# EasyEDA schematic SCH_slime-vr_2022-05-18.json

## Sheets
1 SlimeVR_SCH: TITLE: SlimeVR_SCH; REV: 1.0; Date: 2022-03-29; Sheet: 1/1; Drawn By: 复合体; Company: D9Lab
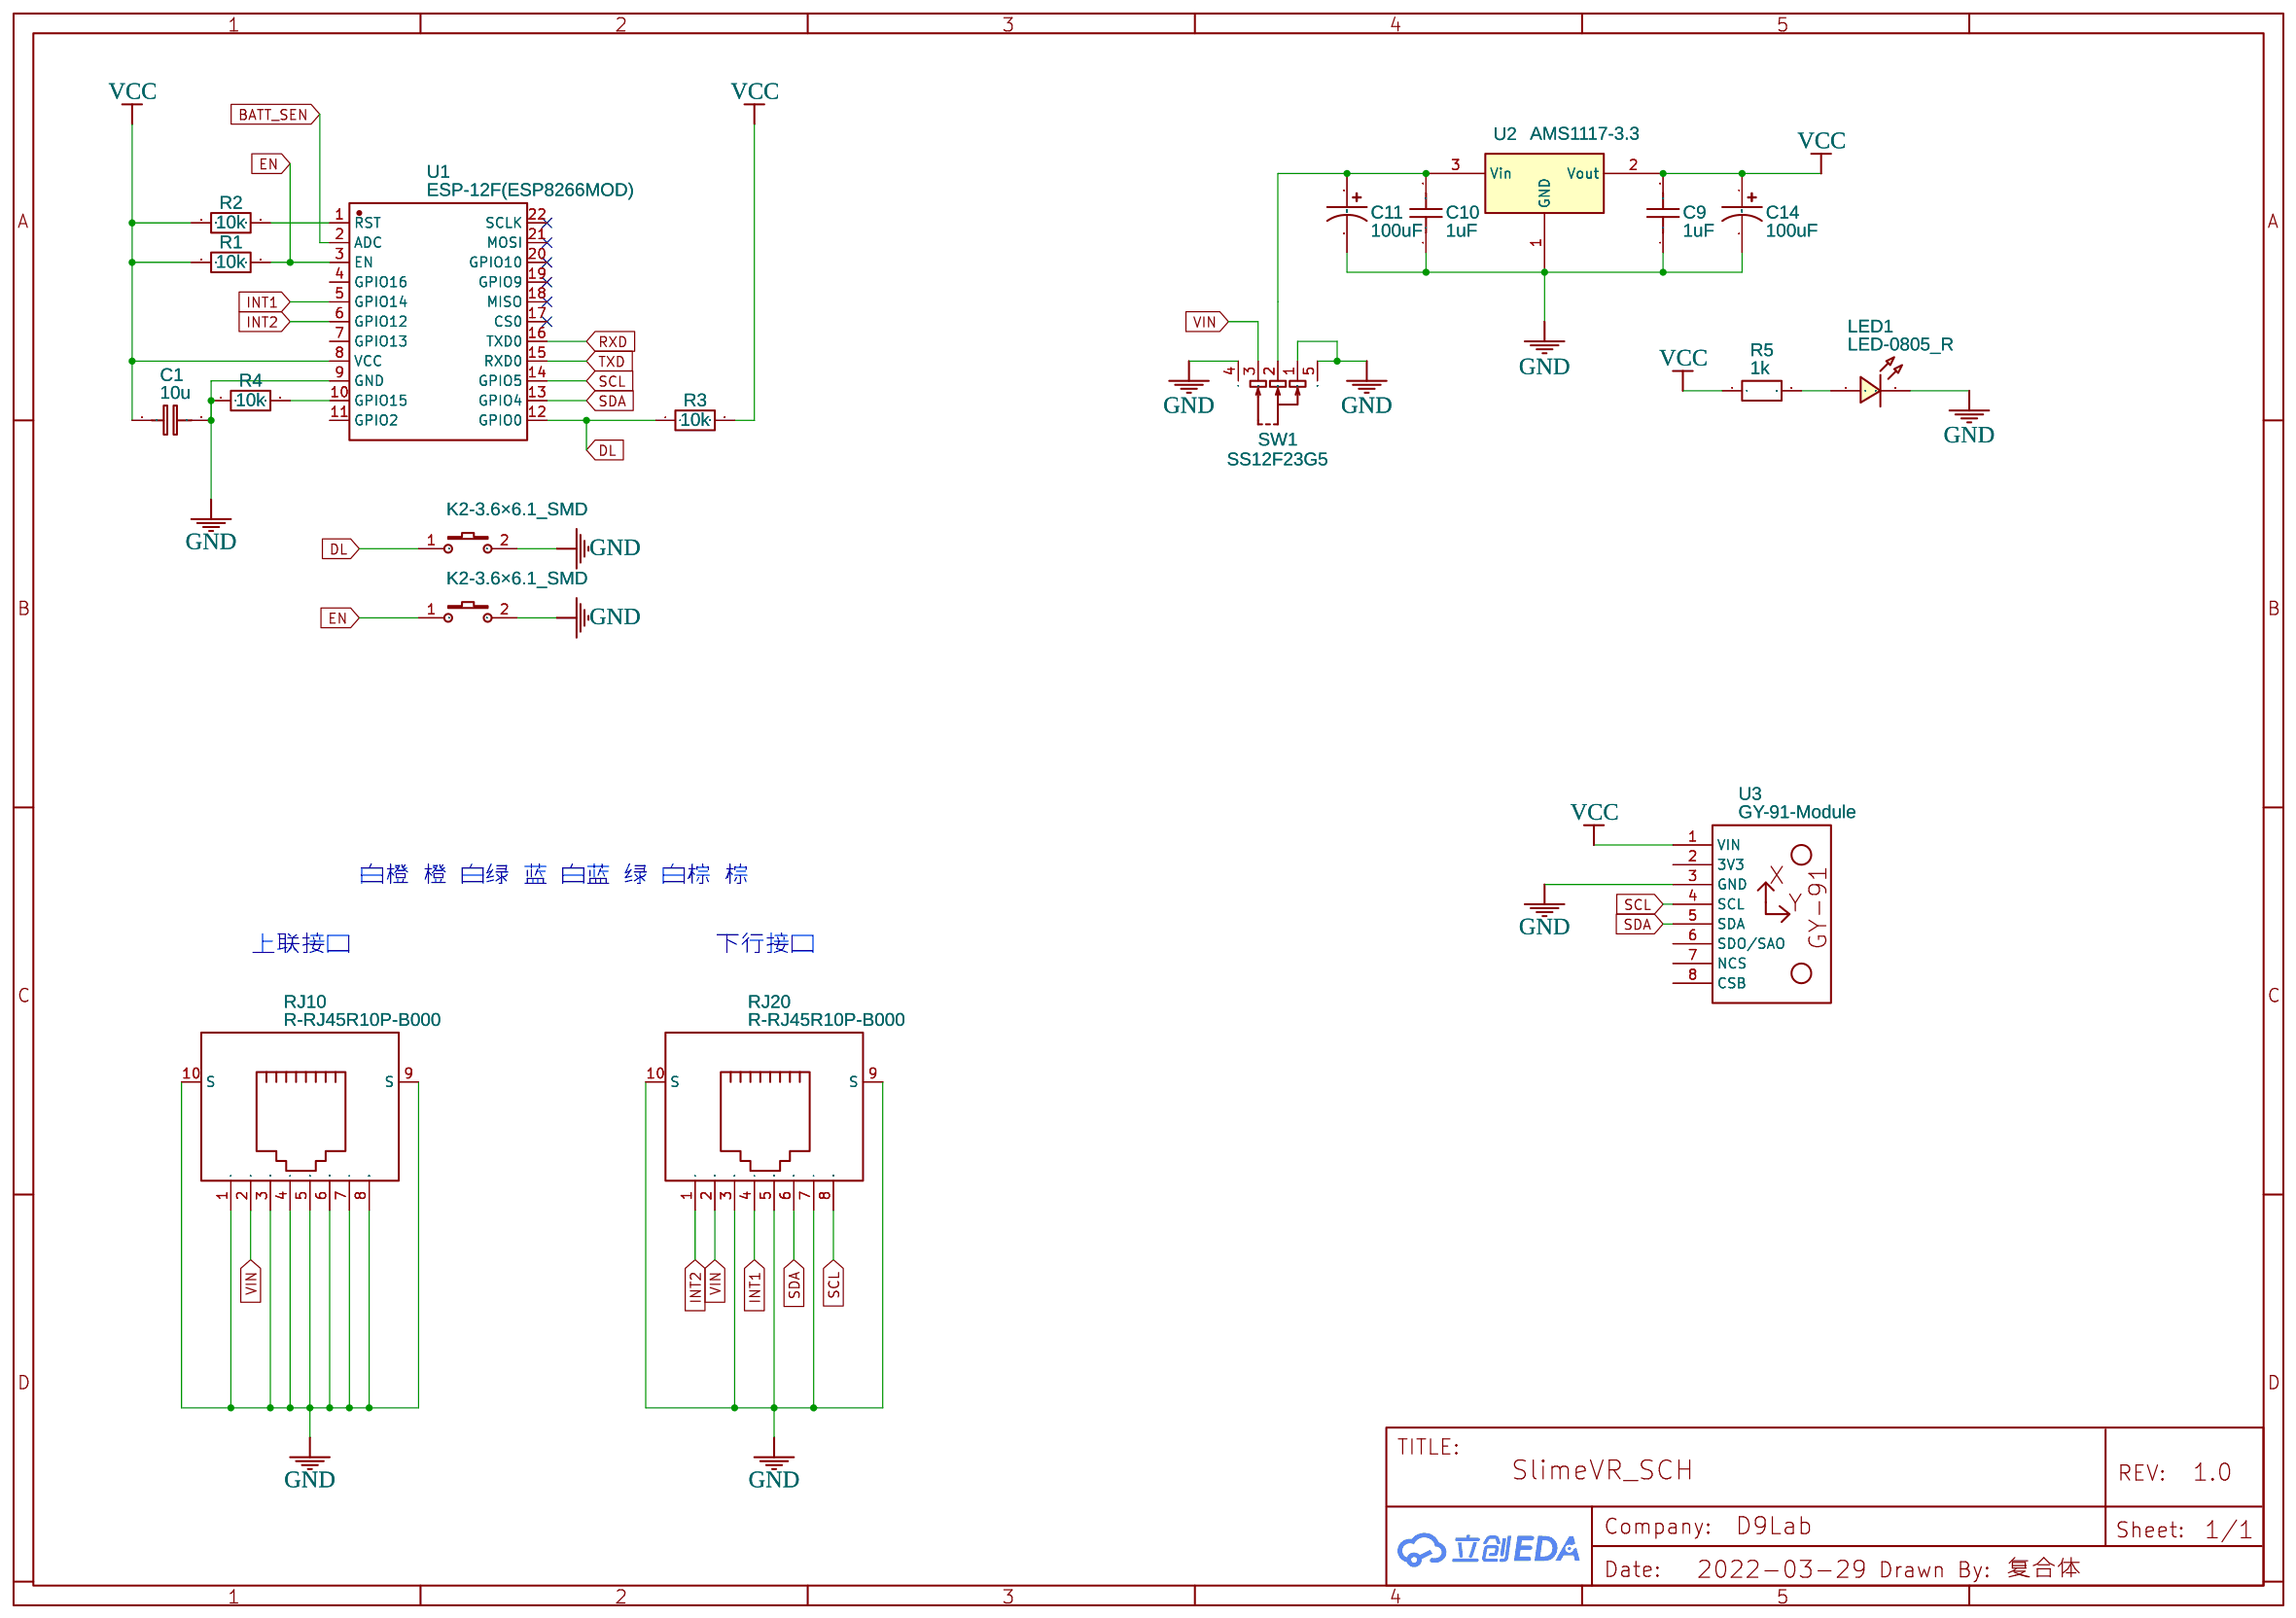
[diagram p0: SlimeVR_SCH]
2 SlimeVR-AUX_SCH: TITLE: SlimeVR-AUX_SCH; Date: 2022-05-18
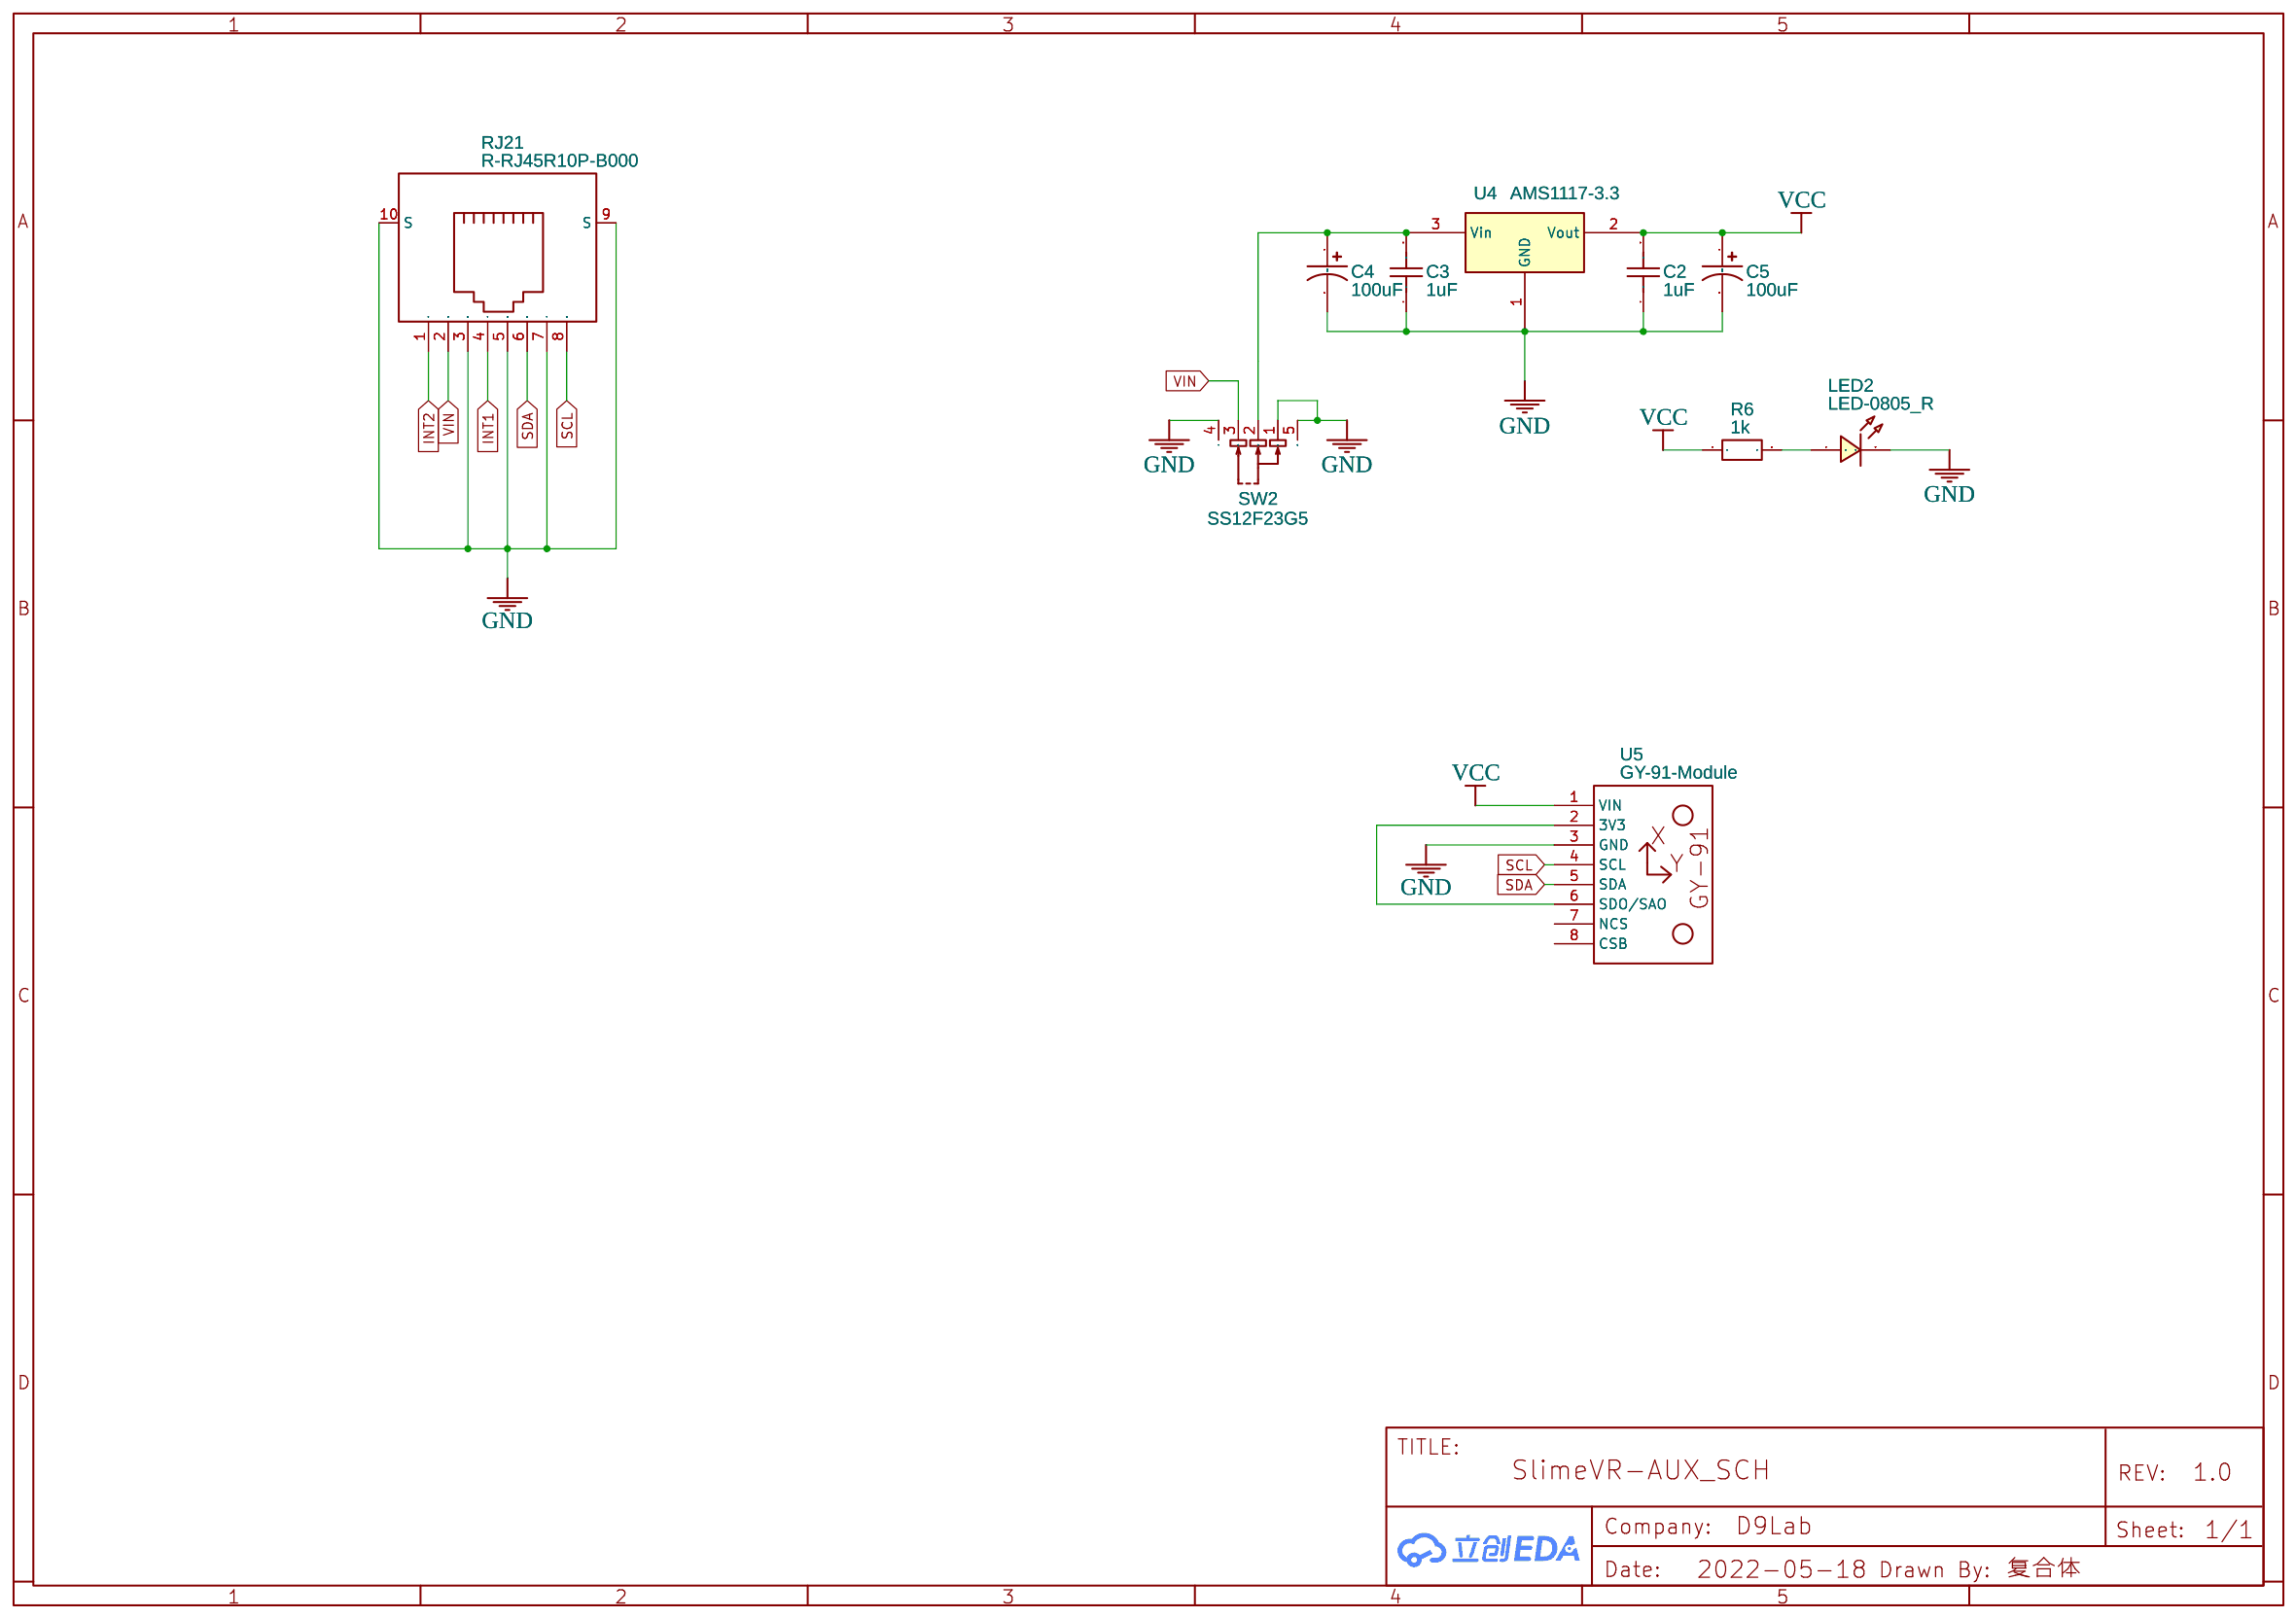
[diagram p1: SlimeVR-AUX_SCH]

## Parts
sheet SlimeVR-AUX_SCH
C2  1uF  [C0805]
C3  1uF  [C0805]
C4  100uF  [CASE-B_3528]
C5  100uF  [CASE-B_3528]
LED2  LED-0805_R  [LED0805_RED]
R6  1k  [R0805]
RJ21  R-RJ45R10P-B000  [RJ45-TH_R-RJ45R10P-B000]
SW2  SS12F23G5  [SW-TH_SHOU-HAN_SS12F23G5]
U4  AMS1117-3.3  [AMS1117]
U5  GY-91-Module  [GY-91]
sheet SlimeVR_SCH
C1  10u  [C0805]
C9  1uF  [C0805]
C10  1uF  [C0805]
C11  100uF  [CASE-B_3528]
C14  100uF  [CASE-B_3528]
DL  K2-3.6×6.1_SMD  [KEY-SMD_2P-L6.2-W3.6-LS8.0]
EN  K2-3.6×6.1_SMD  [KEY-SMD_2P-L6.2-W3.6-LS8.0]
LED1  LED-0805_R  [LED0805_RED]
R1  10k  [R0805]
R2  10k  [R0805]
R3  10k  [R0805]
R4  10k  [R0805]
R5  1k  [R0805]
RJ10  R-RJ45R10P-B000  [RJ45-TH_R-RJ45R10P-B000]
RJ20  R-RJ45R10P-B000  [RJ45-TH_R-RJ45R10P-B000]
SW1  SS12F23G5  [SW-TH_SHOU-HAN_SS12F23G5]
U1  ESP-12F(ESP8266MOD)  [WIFIM-SMD_ESP-12F-ESP8266MOD]
U2  AMS1117-3.3  [AMS1117]
U3  GY-91-Module  [GY-91]

## Library data of the parts
C2 C3 C9 C10 = C_0603_US: Contributor: LCEDA_Lib
C4 C5 C11 C14 = C_Tan_SMD_A_US: Contributor: LCEDA_Lib
LED1 LED2 = LED-0805_R: Manufacturer: EVERLIGHT(台湾亿光); Manufacturer Part: 17-21SURC/S530-A3/TR8; Supplier Part: C72037; Contributor: LCEDA_Lib
R1-R6 = R_0805_EU: Contributor: LCEDA_Lib
RJ10 RJ20 RJ21 = R-RJ45R10P-B000: Supplier: LCSC; Supplier Part: C386758; Manufacturer: Shenzhen Cankemeng; Contributor: LCSC; JLCPCB Part Class: Extended Part
SW1 SW2 = SS12F23G5: Supplier: LCSC; Supplier Part: C2887262; Manufacturer: SHOU HAN(首韩); Contributor: LCSC
U2 U4 = -: catid: 20; sourceId: 0Q2ZvNHZv; Manufacturer Part: ?
U3 U5 = GY-91-Module: Manufacturer Part: GY-91 MPU9250 + BMP280; link: https://www.banggood.com/GY-91-MPU9250-BMP280-10DOF-Acceleration-Gyroscope-Compass-Nine-Shaft-Sensor-Module-p-1129541.html?cur_warehouse=CN; Contributor: ZhangRiven; Supplier Part: https://www.banggood.com/GY-91-MPU9250-BMP280-10DOF-Acceleration-Gyroscope-Compass-Nine-Shaft-Sensor-Module-p-1129541.html?cur_warehouse=CN; Supplier: Banggood
C1 = C_0805_EU: Contributor: LCEDA_Lib
DL EN = K2-3.6×6.1_SMD: Supplier Part: C118141; Supplier: LCSC; Manufacturer Part: K2-1107ST-A4SW-06; Contributor: LCEDA_Lib; 制造商: 韩国韩荣
U1 = ESP-12F(ESP8266MOD): Supplier: LCSC; Manufacturer: Ai-Thinker; Supplier Part: C82891; JLCPCB Part Class: Extended Part

## Nets
GND: C1.2 C2.1 C3.1 C4.2 C5.2 C9.1 C10.1 C11.2 C14.2 DL.2 EN.2 LED1.2 LED2.2 R4.1 RJ10.1 RJ10.3 RJ10.4 RJ10.5 RJ10.6 RJ10.7 RJ10.8 RJ10.9(S) RJ10.10(S) RJ20.3 RJ20.5 RJ20.7 RJ20.9(S) RJ20.10(S) RJ21.3 RJ21.5 RJ21.7 RJ21.9(S) RJ21.10(S) SW1.1 SW1.4 SW1.5 SW2.1 SW2.4 SW2.5 U1.9(GND) U2.1(GND) U3.3(GND) U4.1(GND) U5.3(GND)
VCC: C1.1 C2.2 C5.1 C9.2 C14.1 R1.1 R2.1 R3.2 R5.1 R6.1 U1.8(VCC) U2.2(Vout) U3.1(VIN) U4.2(Vout) U5.1(VIN)
VIN: RJ10.2 RJ20.2 RJ21.2 SW1.3 SW2.3
BATT_SEN: U1.2(ADC)
DL: DL.1 R3.1 U1.12(GPIO0)
EN: EN.1 R1.2 U1.3(EN)
INT1: RJ20.4 RJ21.4 U1.5(GPIO14)
INT2: RJ20.1 RJ21.1 U1.6(GPIO12)
RXD: U1.16(TXD0)
SCL: RJ20.8 RJ21.8 U1.14(GPIO5) U3.4(SCL) U5.4(SCL)
SDA: RJ20.6 RJ21.6 U1.13(GPIO4) U3.5(SDA) U5.5(SDA)
TXD: U1.15(RXD0)
Net-(C3-2): C3.2 C4.1 SW2.2 U4.3(Vin)
Net-(C10-2): C10.2 C11.1 SW1.2 U2.3(Vin)
Net-(LED1-1): LED1.1 R5.2
Net-(LED2-1): LED2.1 R6.2
Net-(R2-2): R2.2 U1.1(RST)
Net-(R4-2): R4.2 U1.10(GPIO15)
Net-(U5-2): U5.2(3V3) U5.6(SDO/SAO)

Not connected (* = marked no-connect by the designer): U1 4(GPIO16) 7(GPIO13) 11(GPIO2) 17(CS0)* 18(MISO)* 19(GPIO9)* 20(GPIO10)* 21(MOSI)* 22(SCLK)*; U3 2(3V3) 6(SDO/SAO) 7(NCS) 8(CSB); U5 7(NCS) 8(CSB)

## Notes on the sheets
sheet 1
- 白橙 橙 白绿 蓝 白蓝 绿 白棕 棕
- 上联接口
- 下行接口
